# Altium schematic sheet buffer.SchDoc
size A4; SheetNumber: 2; SheetTotal: 4
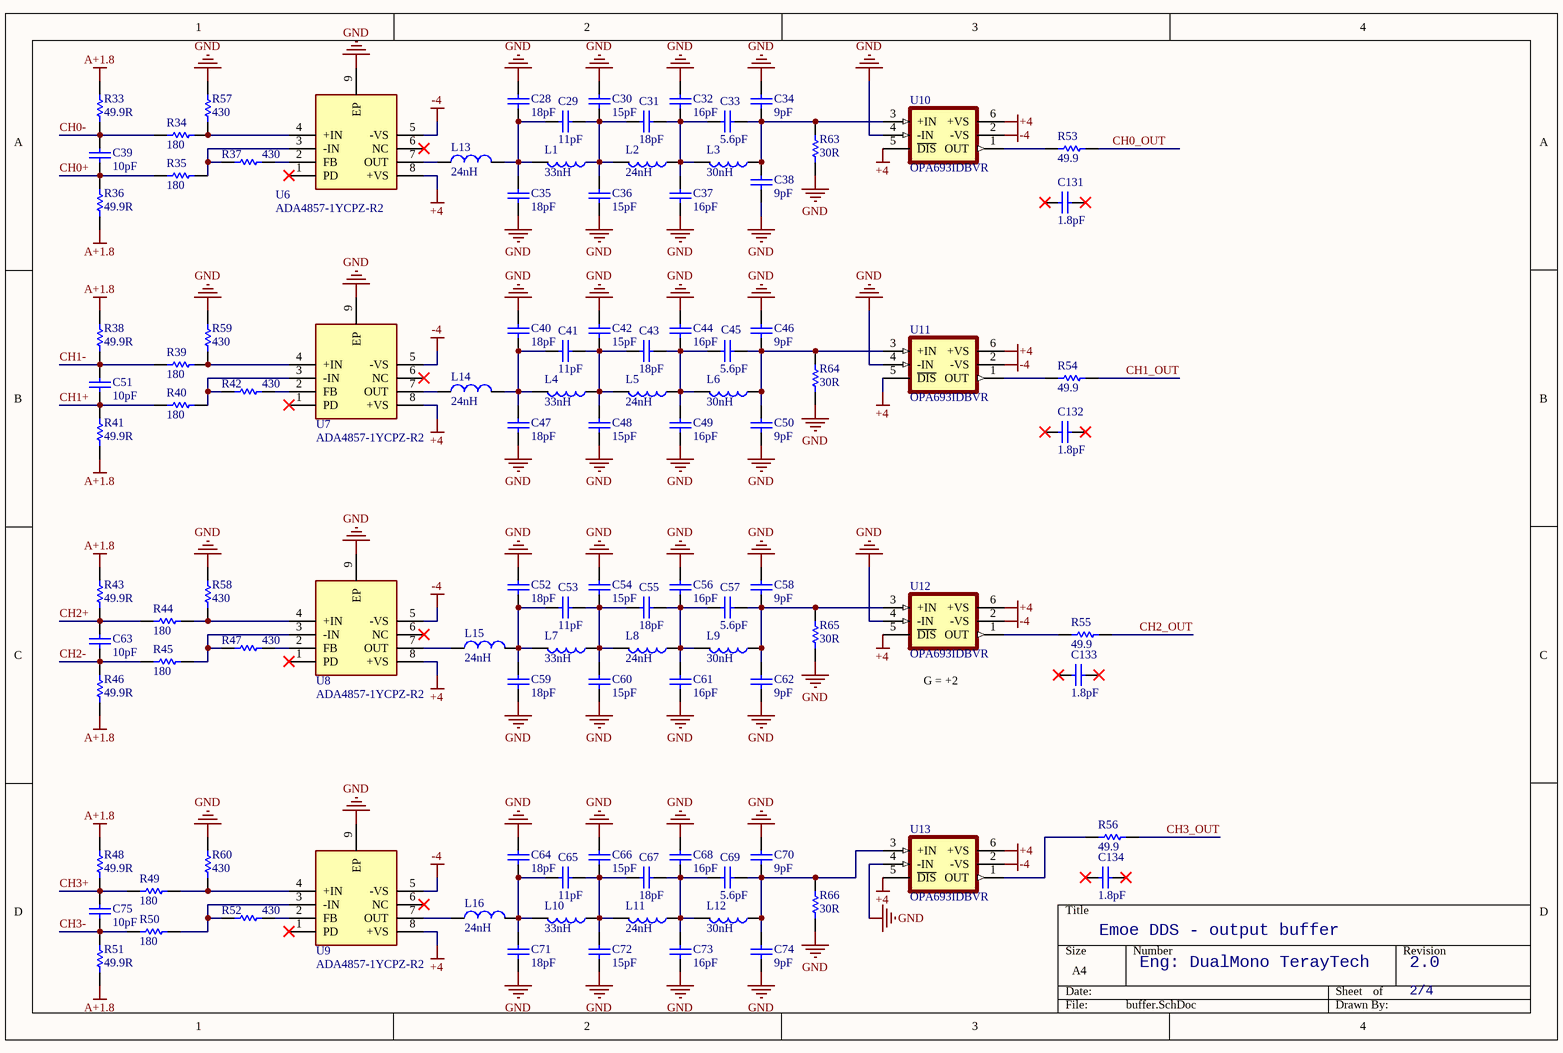
[diagram p0: buffer.SchDoc]

## Parts
C28  18pF  [0402]
C29  11pF  [0402]
C30  15pF  [0402]
C31  18pF  [0402]
C32  16pF  [0402]
C33  5.6pF  [0402]
C34  9pF  [0402]
C35  18pF  [0402]
C36  15pF  [0402]
C37  16pF  [0402]
C38  9pF  [0402]
C39  10pF  [0402]
C40  18pF  [0402]
C41  11pF  [0402]
C42  15pF  [0402]
C43  18pF  [0402]
C44  16pF  [0402]
C45  5.6pF  [0402]
C46  9pF  [0402]
C47  18pF  [0402]
C48  15pF  [0402]
C49  16pF  [0402]
C50  9pF  [0402]
C51  10pF  [0402]
C52  18pF  [0402]
C53  11pF  [0402]
C54  15pF  [0402]
C55  18pF  [0402]
C56  16pF  [0402]
C57  5.6pF  [0402]
C58  9pF  [0402]
C59  18pF  [0402]
C60  15pF  [0402]
C61  16pF  [0402]
C62  9pF  [0402]
C63  10pF  [0402]
C64  18pF  [0402]
C65  11pF  [0402]
C66  15pF  [0402]
C67  18pF  [0402]
C68  16pF  [0402]
C69  5.6pF  [0402]
C70  9pF  [0402]
C71  18pF  [0402]
C72  15pF  [0402]
C73  16pF  [0402]
C74  9pF  [0402]
C75  10pF  [0402]
C131  1.8pF  [0402]
C132  1.8pF  [0402]
C133  1.8pF  [0402]
C134  1.8pF  [0402]
L1  33nH  [0402]
L2  24nH  [0402]
L3  30nH  [0402]
L4  33nH  [0402]
L5  24nH  [0402]
L6  30nH  [0402]
L7  33nH  [0402]
L8  24nH  [0402]
L9  30nH  [0402]
L10  33nH  [0402]
L11  24nH  [0402]
L12  30nH  [0402]
L13  24nH  [0402L]
L14  24nH  [0402L]
L15  24nH  [0402L]
L16  24nH  [0402L]
R33  49.9R  [0402]
R34  180  [0402]
R35  180  [0402]
R36  49.9R  [0402]
R37  430  [0402]
R38  49.9R  [0402]
R39  180  [0402]
R40  180  [0402]
R41  49.9R  [0402]
R42  430  [0402]
R43  49.9R  [0402]
R44  180  [0402]
R45  180  [0402]
R46  49.9R  [0402]
R47  430  [0402]
R48  49.9R  [0402]
R49  180  [0402]
R50  180  [0402]
R51  49.9R  [0402]
R52  430  [0402]
R53  49.9  [0603]
R54  49.9  [0603]
R55  49.9  [0603]
R56  49.9  [0603]
R57  430  [0402]
R58  430  [0402]
R59  430  [0402]
R60  430  [0402]
R63  30R  [0402L]
R64  30R  [0402L]
R65  30R  [0402L]
R66  30R  [0402L]
U6  ADA4857-1YCPZ-R2  [SON50P300X300X85-9N-D]
U7  ADA4857-1YCPZ-R2  [SON50P300X300X85-9N-D]
U8  ADA4857-1YCPZ-R2  [SON50P300X300X85-9N-D]
U9  ADA4857-1YCPZ-R2  [SON50P300X300X85-9N-D]
U10  OPA693IDBVR  [SOT95P280X145-6N]
U11  OPA693IDBVR  [SOT95P280X145-6N]
U12  OPA693IDBVR  [SOT95P280X145-6N]
U13  OPA693IDBVR  [SOT95P280X145-6N]

## Nets
+4: U6.8(+VS) U7.8(+VS) U8.8(+VS) U9.8(+VS) U10.5(~{DIS}) U10.6(+VS) U11.5(~{DIS}) U11.6(+VS) U12.5(~{DIS}) U12.6(+VS) U13.5(~{DIS}) U13.6(+VS)
-4: U6.5(-VS) U7.5(-VS) U8.5(-VS) U9.5(-VS) U10.2(-VS) U11.2(-VS) U12.2(-VS) U13.2(-VS)
A+1.8: R33.1 R36.2 R38.1 R41.2 R43.1 R46.2 R48.1 R51.2
GND: C28.1 C30.1 C32.1 C34.2 C35.2 C36.2 C37.2 C38.1 C40.1 C42.1 C44.1 C46.2 C47.2 C48.2 C49.2 C50.1 C52.1 C54.1 C56.1 C58.2 C59.2 C60.2 C61.2 C62.1 C64.1 C66.1 C68.1 C70.2 C71.2 C72.2 C73.2 C74.1 R57.2 R58.2 R59.2 R60.2 R63.1 R64.1 R65.1 R66.1 U6.9(EP) U7.9(EP) U8.9(EP) U9.9(EP) U10.4(-IN) U11.4(-IN) U12.4(-IN) U13.4(-IN)
CH0+: C39.1 R35.1 R36.1
CH0-: C39.2 R33.2 R34.1
CH0_OUT: R53.2
CH1+: C51.1 R40.1 R41.1
CH1-: C51.2 R38.2 R39.1
CH1_OUT: R54.2
CH2+: C63.2 R43.2 R44.1
CH2-: C63.1 R45.1 R46.1
CH2_OUT: R55.2
CH3+: C75.2 R48.2 R49.1
CH3-: C75.1 R50.1 R51.1
CH3_OUT: R56.2
NetC28_2: C28.2 C29.1 C35.1 L1.2 L13.2
NetC29_2: C29.2 C30.2 C31.1 C36.1 L1.1 L2.2
NetC31_2: C31.2 C32.2 C33.1 C37.1 L2.1 L3.2
NetC33_2: C33.2 C34.1 C38.2 L3.1 R63.2 U10.3(+IN)
NetC40_2: C40.2 C41.1 C47.1 L4.2 L14.2
NetC41_2: C41.2 C42.2 C43.1 C48.1 L4.1 L5.2
NetC43_2: C43.2 C44.2 C45.1 C49.1 L5.1 L6.2
NetC45_2: C45.2 C46.1 C50.2 L6.1 R64.2 U11.3(+IN)
NetC52_2: C52.2 C53.1 C59.1 L7.2 L15.2
NetC53_2: C53.2 C54.2 C55.1 C60.1 L7.1 L8.2
NetC55_2: C55.2 C56.2 C57.1 C61.1 L8.1 L9.2
NetC57_2: C57.2 C58.1 C62.2 L9.1 R65.2 U12.3(+IN)
NetC64_2: C64.2 C65.1 C71.1 L10.2 L16.2
NetC65_2: C65.2 C66.2 C67.1 C72.1 L10.1 L11.2
NetC67_2: C67.2 C68.2 C69.1 C73.1 L11.1 L12.2
NetC69_2: C69.2 C70.1 C74.2 L12.1 R66.2 U13.3(+IN)
NetL13_1: L13.1 U6.7(OUT)
NetL14_1: L14.1 U7.7(OUT)
NetL15_1: L15.1 U8.7(OUT)
NetL16_1: L16.1 U9.7(OUT)
NetR34_2: R34.2 R57.1 U6.4(+IN)
NetR35_2: R35.2 R37.1 U6.3(-IN)
NetR37_2: R37.2 U6.2(FB)
NetR39_2: R39.2 R59.1 U7.4(+IN)
NetR40_2: R40.2 R42.1 U7.3(-IN)
NetR42_2: R42.2 U7.2(FB)
NetR44_2: R44.2 R58.1 U8.4(+IN)
NetR45_2: R45.2 R47.1 U8.3(-IN)
NetR47_2: R47.2 U8.2(FB)
NetR49_2: R49.2 R60.1 U9.4(+IN)
NetR50_2: R50.2 R52.1 U9.3(-IN)
NetR52_2: R52.2 U9.2(FB)
NetR53_1: R53.1 U10.1(OUT)
NetR54_1: R54.1 U11.1(OUT)
NetR55_1: R55.1 U12.1(OUT)
NetR56_1: R56.1 U13.1(OUT)

Not connected (* = marked no-connect by the designer): C131 1* 2*; C132 1* 2*; C133 1* 2*; C134 1* 2*; U6 1(PD)* 6(NC)*; U7 1(PD)* 6(NC)*; U8 1(PD)* 6(NC)*; U9 1(PD)* 6(NC)*

## Notes on the sheet
- (near U12) G = +2
- (near C134) Emoe DDS - output buffer
- Eng: DualMono TerayTech
- 2.0
- 2/4

## Library data of the parts
C28-C75 C131-C134 = CAP: Capacitor; Value: 104; Published: 8-Jun-2000; LatestRevisionDate: 17-Jul-2002; LatestRevisionNote: Re-released for DXP Platform.; PackageReference: RAD-0.3; Publisher: Altium Limited
L1-L12 = FB
L13-L16 = Inductor
R33-R60 R63-R66 = RES: Resistor; Value: 1K; Published: 8-Jun-2000; Revision: July-2002: Re-released for DXP Platform.; Publisher: Altium Limited
U6-U9 = ADA4857-1YCPZ-R2: Integrated Circuit; Manufacturer_Name: Analog Devices; Datasheet Link: https://g.componentsearchengine.com/Datasheets/1/ADA4857-1YCPZ-R2.pdf; Height: 0.85mm; Manufacturer_Part_Number: ADA4857-1YCPZ-R2; Mouser Part Number: 584-ADA4857-1YCPZ-R2; Mouser Price/Stock: http://www.mouser.com/Search/ProductDetail.aspx?qs=pqQDoYZ2quYEvaTEvq9xqQ%3d%3d
U10-U13 = OPA693IDBVR: Ultra-Wideband, Fixed Gain Video Buffer Amplifier with Disable; MF: Texas Instruments; Availability: In Stock; Package: SOT-23-6 Texas Instruments; MP: OPA693IDBVR; Value: *; Purchase-URL: https://pricing.snapeda.com/search/part/OPA693IDBVR/?ref=eda; SnapEDA_Link: https://www.snapeda.com/parts/OPA693IDBVR/Texas+Instruments/view-part/?ref=snap; Price: None; Check_prices: https://www.snapeda.com/parts/OPA693IDBVR/Texas+Instruments/view-part/?ref=eda